# EAGLE design smd (EAGLE 7.3.0)
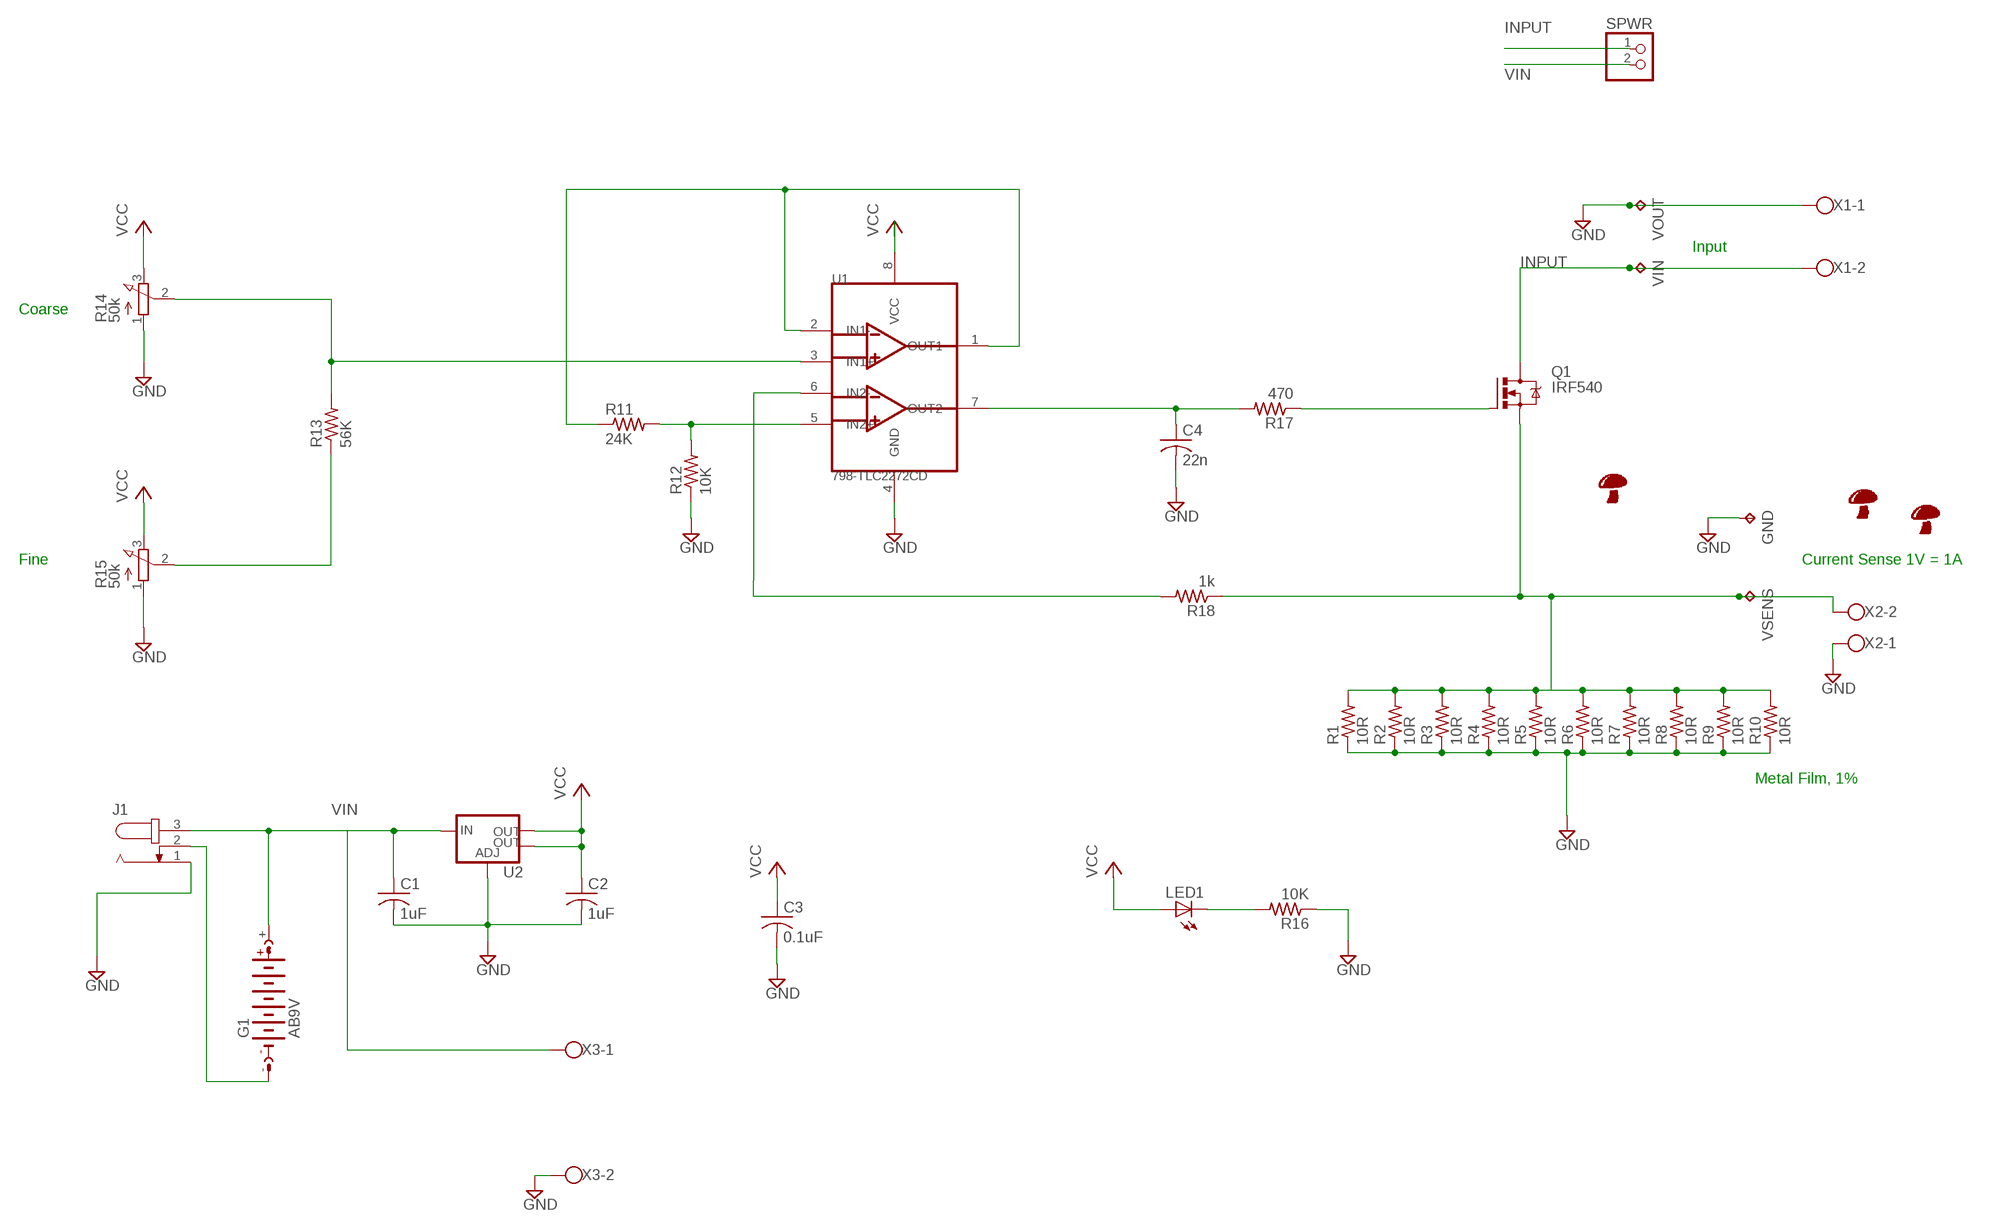
[diagram p0: schematic, sheet 1]

## Parts
C1  1uF  C-USC0805  [C0805]
C2  1uF  C-USC0805  [C0805]
C3  0.1uF  C-USC0805  [C0805]
C4  22n  C-USC0805  [C0805]
G1  AB9V  [AB9V]
GND  TPPAD1-13Y  [P1-13Y]
J1  JACK-PLUG0  [SPC4077]
LED1  LEDCHIP-LED0805  [CHIP-LED0805]
Q1  IRF540  [TO220BV]
R1  10R  R-US_R2512  [R2512]
R2  10R  R-US_R2512  [R2512]
R3  10R  R-US_R2512  [R2512]
R4  10R  R-US_R2512  [R2512]
R5  10R  R-US_R2512  [R2512]
R6  10R  R-US_R2512  [R2512]
R7  10R  R-US_R2512  [R2512]
R8  10R  R-US_R2512  [R2512]
R9  10R  R-US_R2512  [R2512]
R10  10R  R-US_R2512  [R2512]
R11  24K  R-US_M0805  [M0805]
R12  10K  R-US_M0805  [M0805]
R13  56K  R-US_M0805  [M0805]
R14  50k  3RP/1610N  [3RP/1610N]
R15  50k  3RP/1610N  [3RP/1610N]
R16  10K  R-US_M0805  [M0805]
R17  470  R-US_M0805  [M0805]
R18  1k  R-US_M0805  [M0805]
SPWR  PINHD-1X2  [1X02]
U1  798-TLC2272CD  [ANDREW/B6D66]
U2  V_REG_LM1117SOT223  [SOT223]
U$1  SHROOM5MM  [SHROOM]
U$2  SHROOM10MM  [SHROOM10MM]
U$3  SHROOMTOPSILK  [SHROOM_TS]
VIN  TPPAD1-13Y  [P1-13Y]
VOUT  TPPAD1-13Y  [P1-13Y]
VSENS  TPPAD1-13Y  [P1-13Y]
X1  W237-102  [W237-102]
X2  W237-102  [W237-102]
X3  W237-102  [W237-102]

## Nets
AUXIN: G1.- J1.2
GND: C1.2 C2.2 C3.2 C4.2 GND.TP J1.1 R1.1 R2.1 R3.1 R4.1 R5.1 R6.1 R7.1 R8.1 R9.1 R10.1 R12.1 R14.1(A) R15.1(A) R16.1 U1.4(GND) U2.1(ADJ) VOUT.TP X1.1 X2.1 X3.2
INPUT: Q1.D SPWR.1 VIN.TP X1.2
N$2: Q1.S R1.2 R2.2 R3.2 R4.2 R5.2 R6.2 R7.2 R8.2 R9.2 R10.2 R18.1 VSENS.TP X2.2
N$4: R18.2 U1.6(IN2-)
N$6: R11.1 U1.1(OUT1) U1.2(IN1-)
N$7: R11.2 R12.2 U1.5(IN2+)
N$8: R13.2 R14.2(S) U1.3(IN1+)
N$9: R13.1 R15.2(S)
N$10: LED1.C R16.2
N$11: C4.1 R17.2 U1.7(OUT2)
N$12: Q1.G R17.1
VCC: C2.1 C3.1 LED1.A R14.3(E) R15.3(E) U1.8(VCC) U2.2(OUT) U2.4(OUT)
VIN: C1.1 G1.+ J1.3 SPWR.2 U2.3(IN) X3.1

## Notes on the sheet
- Input
- Coarse
- Fine | Current Sense 1V = 1A
- Metal Film, 1%

## Library data of the parts
C1-C4 = resistor:C-US: CAPACITOR, American symbol
G1 = battery:AB9V: 9-V BATTERY CLIP
GND VIN VOUT VSENS = testpad:TP: Test pad
J1 = con-jack:JACK-PLUG: DC POWER JACK Power Jack, DC, Right Angle, Through Hole, Rated 5A at 16VDC, PC Terminals Distributor: Farnell (www.Farnell.de) Drawing: 84N1161.pdf / 84N1162.pdf Manufacturer: SPC Technology (www.spctechnology.com) Type: SPC4077 / SPC 4078; OC_FARNELL: unknown; OC_NEWARK: unknown
LED1 = led:LED: LED OSRAM: - CHIPLED LG R971, LG N971, LY N971, LG Q971, LY Q971, LO R971, LY R971 LH N974, LH R974 LS Q976, LO Q976, LY Q976 LO Q996 - Hyper CHIPLED LW Q18S LB Q993, LB Q99A, LB R99A - SideLED LS A670, LO A670, LY A670, LG A670, LP A670 LB A673, LV A673, LT A673, LW A673 LH A674 LY A675 LS A676, LA A676, LO A676, LY A676, LW A676 LS A679, LY A679, LG A679 - Hyper Micro SIDELED® LS Y876, LA Y876, LO Y876, LY Y876 LT Y87S - SmartLED LW L88C, LW L88S LB L89C, LB L89S, LG L890 LS L89K, LO L89K, LY L89K LS L896, LA L896, LO L896, LY L896 - TOPLED LS T670, LO T670, LY T670, LG T670, LP T670 LSG T670, LSP T670, LSY T670, LOP T670, LYG T670 LG T671, LOG T671, LSG T671 LB T673, LV T673, LT T673, LW T673 LH T674 LS T676, LA T676, LO T676, LY T676, LB T676, LH T676, LSB T676, LW T676 LB T67C, LV T67C, LT T67C, LS T67K, LO T67K, LY T67K, LW E67C LS E67B, LA E67B, LO E67B, LY E67B, LB E67C, LV E67C, LT E67C LW T67C LS T679, LY T679, LG T679 LS T770, LO T770, LY T770, LG T770, LP T770 LB T773, LV T773, LT T773, LW T773 LH T774 LS E675, LA E675, LY E675, LS T675 LS T776, LA T776, LO T776, LY T776, LB T776 LHGB T686 LT T68C, LB T68C - Hyper Mini TOPLED® LB M676 - Mini TOPLED Santana® LG M470 LS M47K, LO M47K, LY M47K Source: http://www.osram.convergy.de LUXEON: - LUMILED® LXK2-PW12-R00, LXK2-PW12-S00, LXK2-PW14-U00, LXK2-PW14-V00 LXK2-PM12-R00, LXK2-PM12-S00, LXK2-PM14-U00 LXK2-PE12-Q00, LXK2-PE12-R00, LXK2-PE12-S00, LXK2-PE14-T00, LXK2-PE14-U00 LXK2-PB12-K00, LXK2-PB12-L00, LXK2-PB12-M00, LXK2-PB14-N00, LXK2-PB14-P00, LXK2-PB14-Q00 LXK2-PR12-L00, LXK2-PR12-M00, LXK2-PR14-Q00, LXK2-PR14-R00 LXK2-PD12-Q00, LXK2-PD12-R00, LXK2-PD12-S00 LXK2-PH12-R00, LXK2-PH12-S00 LXK2-PL12-P00, LXK2-PL12-Q00, LXK2-PL12-R00 Source: www.luxeon.com KINGBRIGHT: KA-3528ASYC Source: www.kingbright.com
Q1 = transistor-power:IRF540: HEXFET Power MOSFET
R1-R13 R16-R18 = resistor:R-US_: RESISTOR, American symbol
R14 R15 = pot:3RP/1610N: 16mm Potentiometer one level Source: http://www.alphapotentiometers.net/html/16mm_pot_2.html
SPWR = pinhead:PINHD-1X2: PIN HEADER
U1 = CircuitHub:798-TLC2272CD; URL: https://circuithub.com/parts/TI/TLC2272CD
U2 = SparkFun-PowerIC:V_REG_LM1117: Voltage Regulator LM1117 Standard adjustable voltage regulator but in SMD form. Spark Fun Electronics SKU : COM-00595; PROD_ID: VREG-08170
U$1-U$3 = RobThePyro:SHROOM
X1-X3 = con-wago-500:W237-102: WAGO SCREW CLAMP; MPN: 237-102; OC_FARNELL: unknown; OC_NEWARK: 70K9898

## Board
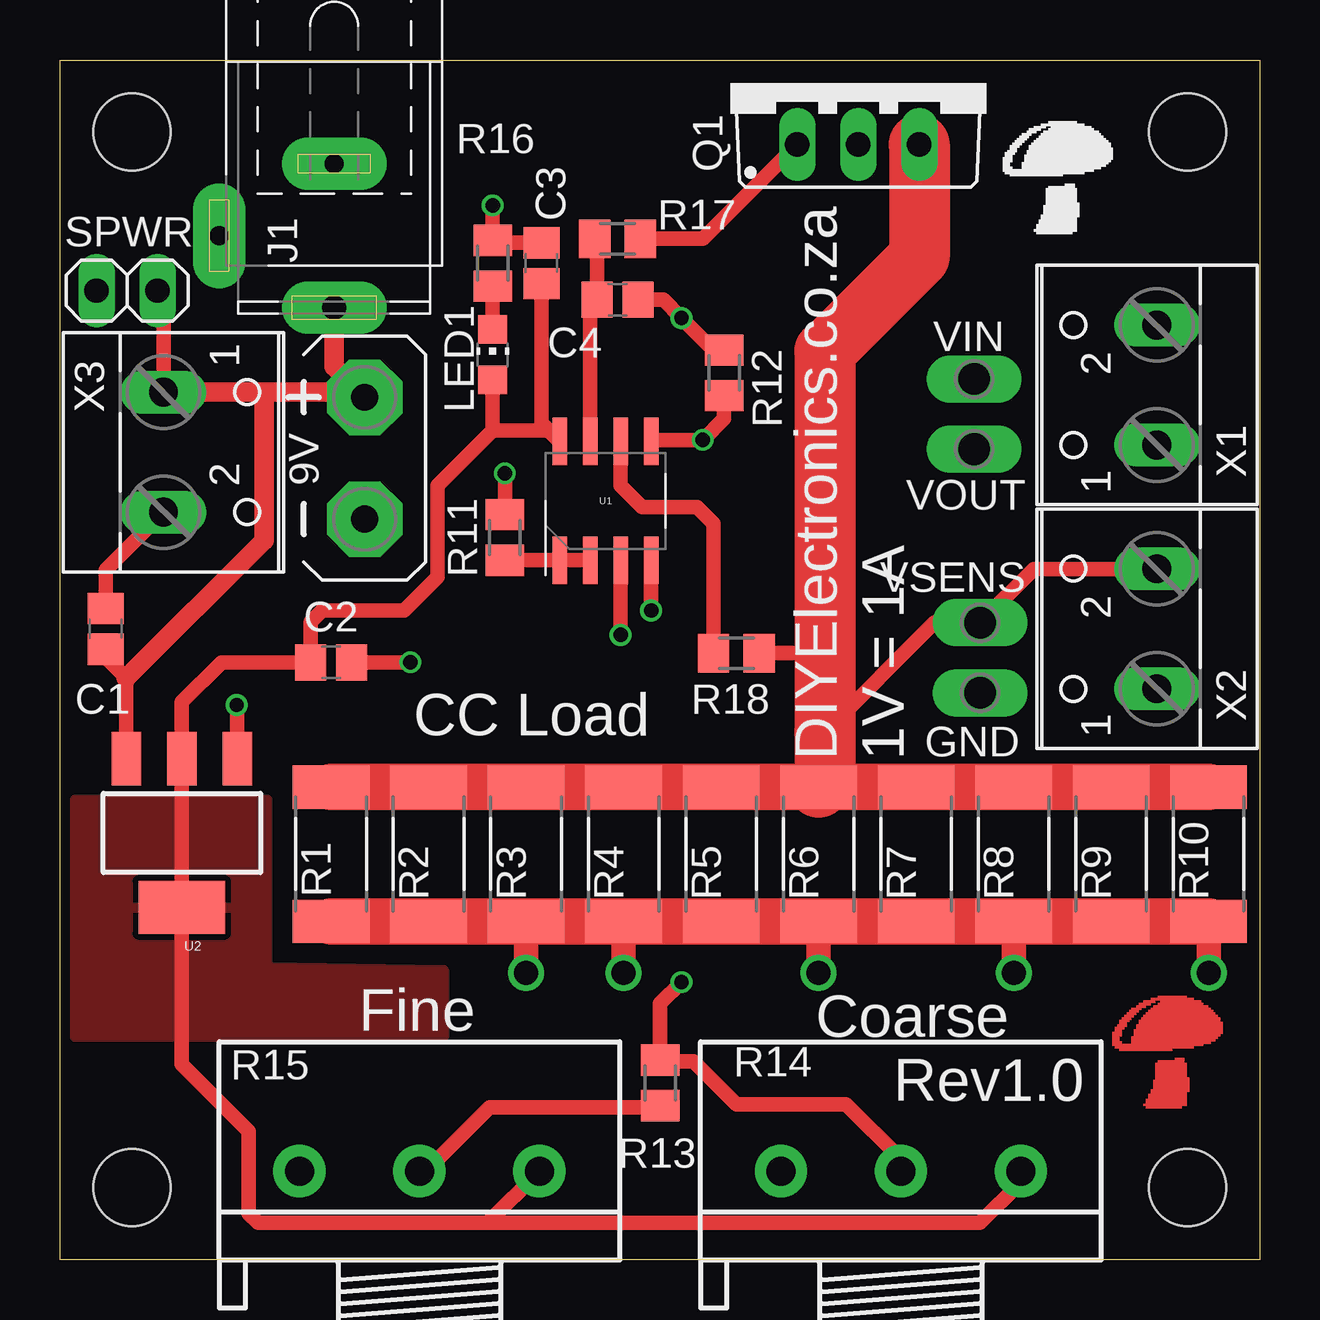
[diagram p1: board, top side]
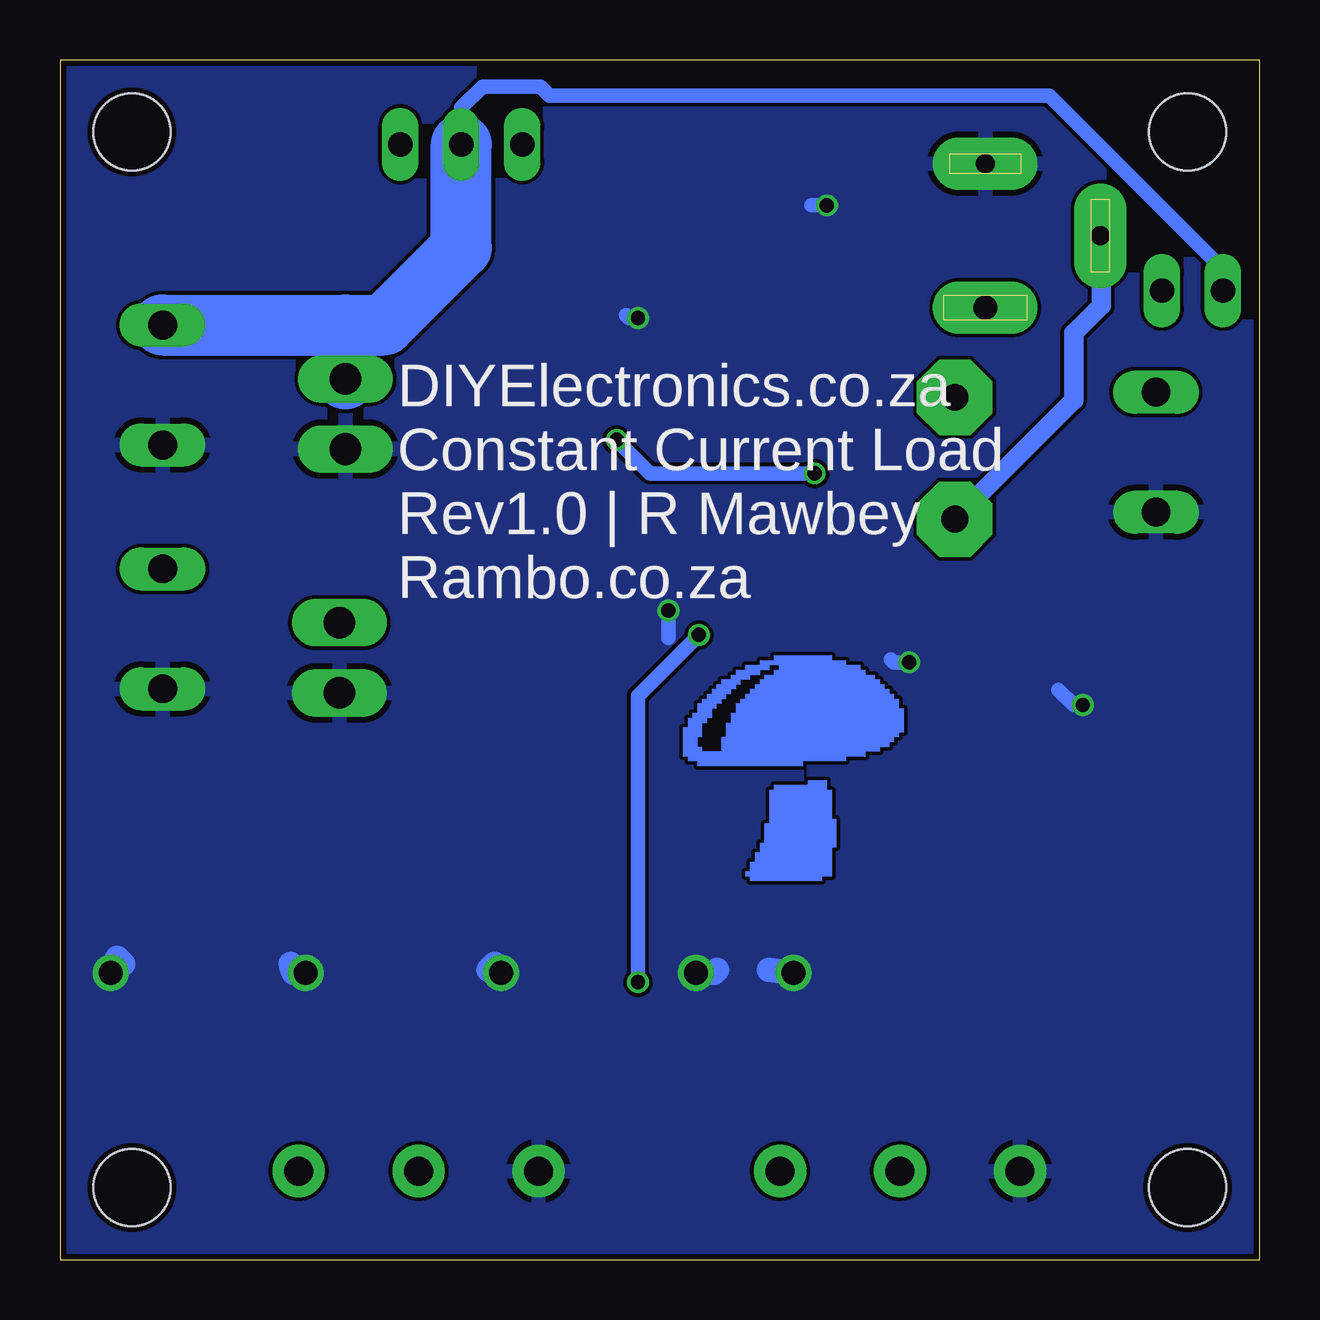
[diagram p2: board, bottom side, seen from below]

Size 50 x 50 mm. Coordinates in mm from the lower left corner, seen from the top.
Outline: 0,0 0,50 50,50 50,0 0,0
Copper layers (1*16): Top 0.035mm / dielectric 1.5mm / Bottom 0.035mm
Design rules "SeeedStudio_2layer_DRU_no_angle_20140221": minimum track width 6mil, minimum drill 12mil, track to track 6mil, track to pad 6mil, pad to pad 6mil, via to via 6mil, smd to smd 0mil, copper to edge 10mil, drill to drill 10mil, minimum pad ring 10mil, minimum via ring 6mil, stop-mask expansion 2mil, vias tented up to drill 100mil, thermal gap 10mil
Holes 3.2 mm at 47,47 3,47 3,3 47,3

### Footprints (pad centres in the part's own frame; a part is rotated, then mirrored left to right if it is on the bottom)
C0805 = smd 1.3 x 1.5: 1 -0.85,0; 2 0.85,0
AB9V = drill 1.118 pad 3.15 octagon: + 0,2.54; - 0,-2.54
P1-13Y = drill 1.321 pad 1.905 long: TP 0,0
SPC4077 = drill 0.8 pad 2.184 long: 1 -3,0; 2 0,-4.8 | drill 1 pad 2.184 long: 3 3,0
CHIP-LED0805 = smd 1.2 x 1.2: A 0,-1.05; C 0,1.05
TO220BV = drill 1.016 long: D 0,-2.54; G -2.54,-2.54; S 2.54,-2.54
R2512 = smd 1.8 x 3.2: 1 -2.8,0; 2 2.8,0
M0805 = smd 1.3 x 1.6: 1 -0.95,0; 2 0.95,0
3RP/1610N = drill 1.2 pad 2.184: 1 -5,0; 2 0,0; 3 5,0
1X02 = drill 1.016 long: 1 -1.27,0; 2 1.27,0
ANDREW/B6D66 = smd 0.6 x 1.98: 1 -1.905,-2.475; 2 -0.635,-2.475; 3 0.635,-2.475; 4 1.905,-2.475; 5 1.905,2.475; 6 0.635,2.475; 7 -0.635,2.475; 8 -1.905,2.475
SOT223 = smd 1.219 x 2.235: 1 -2.311,-3.099; 2 0,-3.099; 3 2.311,-3.099 | smd 3.6 x 2.2: 4 0,3.099
W237-102 = drill 1.194 long: 1 -2.5,-1.27; 2 2.5,-1.27

### Placement (x,y rotation side)
C1  1.91,26.29 90 top
C2  11.3,24.89 0 top
C3  20.07,41.53 90 top
C4  23.24,40.01 0 top
G1  12.7,33.4 0 top
GND  38.35,23.62 90 top
J1  11.43,42.67 270 top
LED1  18.03,37.72 0 top
Q1  33.27,49.02 0 top
R1  11.3,16.89 90 top
R2  15.37,16.89 90 top
R3  19.43,16.89 90 top
R4  23.5,16.89 90 top
R5  27.56,16.89 90 top
R6  31.62,16.89 90 top
R7  35.69,16.89 90 top
R8  39.75,16.89 90 top
R9  43.81,16.89 90 top
R10  47.88,16.89 90 top
R11  18.54,30.1 90 top
R12  27.69,36.96 270 top
R13  25.02,7.37 90 top
R14  35.05,3.68 0 top
R15  14.99,3.68 0 top
R16  18.03,41.53 270 top
R17  23.24,42.55 180 top
R18  28.19,25.27 180 top
SPWR  2.79,40.39 0 top
U1  22.73,31.62 0 top
U2  5.08,17.78 180 top
U$1  43.81,6.35 0 top
U$2  24.13,15.88 0 bottom
U$3  39.24,42.8 0 top
VIN  38.1,36.7 90 top
VOUT  38.1,33.78 90 top
VSENS  38.35,26.54 90 top
X1  44.45,36.45 90 top
X2  44.45,26.29 90 top
X3  5.59,33.66 270 top

### Tracks (layer width: path | path; a pad name or v marks a point on that pad's centre or on a via)
AUXIN
  Bottom 0.813: G1.- 7.75,35.81 7.75,38.61 6.6,39.75 6.6,42.65 J1.2
GND  (via drill 0.6, 1)
  Top 0.61: C1.2 1.91,28.74 X3.2 | C2.2 v14.61,24.89 | v18.03,43.94 R16.1 18.13,42.38 C3.2 | C4.2 25.15,40.01 v25.91,39.24 27.24,37.91 R12.1 | U1.4 v24.64,27.05 | U2.1 7.39,23.09 v7.37,23.11
  Top 1.016: R3.1 v19.43,11.94 | R6.1 v31.62,11.94 | R8.1 v39.75,11.94 | R10.1 v47.88,11.94 | R4.1 v23.5,11.94
  Top 1.93: R10.1 R9.1 R8.1 R7.1 R6.1 R5.1 R4.1 R3.1 R2.1 R1.1
  Bottom 0.61: v14.61,24.89 15.24,24.89 15.37,25.02 | v18.03,43.94 18.67,43.94 | v25.91,39.24 26.29,39.24 26.42,39.37 | v24.64,27.05 24.64,25.91 | v7.37,23.11 7.75,23.11 8.38,23.75
  Bottom 1.016: v19.43,11.94 20.45,12.06 | v31.62,11.94 31.88,12.32 32.13,12.06 | v39.75,11.94 40.26,11.94 40.39,12.32 | v47.88,11.94 47.62,12.57 47.37,12.32 | v23.5,11.94 22.73,11.94 22.61,12.06
  pour Bottom: 0,0 0,50 50,50 50,0
INPUT
  Bottom 0.61: SPWR.1 1.52,41.27 8.76,48.51 29.59,48.51 29.97,48.9 32.38,48.9 33.27,48.01 Q1.D
  Bottom 2.54: X1.2 38.1,38.95 | 38.1,38.95 36.49,38.95 33.27,42.16 Q1.D | VIN.TP 38.1,38.95
N$2
  Top 0.61: R18.1 31.62,25.27 31.75,25.15 31.88,25.15 | X2.2 40.6,28.79 VSENS.TP 36.45,26.54 31.88,21.97
  Top 1.93: R10.2 R9.2 R8.2 R7.2 R6.2 | R6.2 R5.2 R4.2 R3.2 R2.2 R1.2 | 31.75,19.82 R6.2
  Top 2.54: Q1.S 35.81,41.78 31.88,37.85 31.88,25.15 31.88,21.97 31.88,19.95 R6.2
N$4
  Top 0.61: R18.2 27.24,30.67 26.54,31.37 24.26,31.37 23.37,32.26 U1.6
N$6
  Top 0.61: U1.2 U1.1 R11.1
N$7  (via drill 0.6)
  Top 0.61: R11.2 v18.54,32.77 | U1.5 24.7,34.16 v26.8,34.16 27.69,35.05 R12.2
  Bottom 0.61: v18.54,32.77 25.4,32.77 v26.8,34.16
N$8  (via drill 0.6)
  Top 0.61: v23.37,26.04 U1.3 | v25.91,11.56 25.02,10.67 R13.2 25.08,8.26 26.42,8.26 28.19,6.48 32.77,6.48 35.05,4.19 R14.2
  Bottom 0.61: v25.91,11.56 25.91,23.5 v23.37,26.04
N$9
  Top 0.61: 24.96,6.48 R13.1 24.95,6.35 17.91,6.35 15.24,3.68 R15.2
N$10
  Top 0.61: LED1.C R16.2
N$11
  Top 0.61: U1.7 22.1,39.71 C4.1 22.39,42.45 R17.2
N$12
  Top 0.61: R17.1 26.8,42.55 Q1.G
VCC
  Top 0.61: 18.03,34.54 15.75,32.26 15.75,28.45 14.35,27.05 10.92,27.05 10.45,26.58 C2.1 6.73,24.89 5.08,23.24 U2.2 U2.4 5.08,8.13 7.87,5.33 7.87,1.91 8.26,1.52 17.65,1.52 17.83,1.52 | 18.03,34.54 20.38,34.54 U1.8 20.07,34.86 C3.1 | 18.03,34.54 LED1.A | 17.83,1.52 R15.3 | R14.3 40.05,3.22 38.35,1.52 17.83,1.52
  pour Top: 0.64,19.18 8.64,19.18 8.64,12.19 16,12.06 16,9.27 0.64,9.27
VIN
  Top 0.61: U2.3 2.77,24.23 1.91,25.09 C1.1 | X3.1 4.32,40.13 SPWR.2
  Top 0.813: J1.3 11.43,37.21 G1.+ 12.49,36.16 X3.1 8.42,36.16 8.51,36.07 8.51,29.97 2.77,24.23

### Text on the board
tNames: CC Load | DIYElectronics.co.za | 1V = 1A | Fine | Coarse | Rev1.0
bNames: DIYElectronics.co.za / Constant Current Load / Rev1.0 | R Mawbey / Rambo.co.za